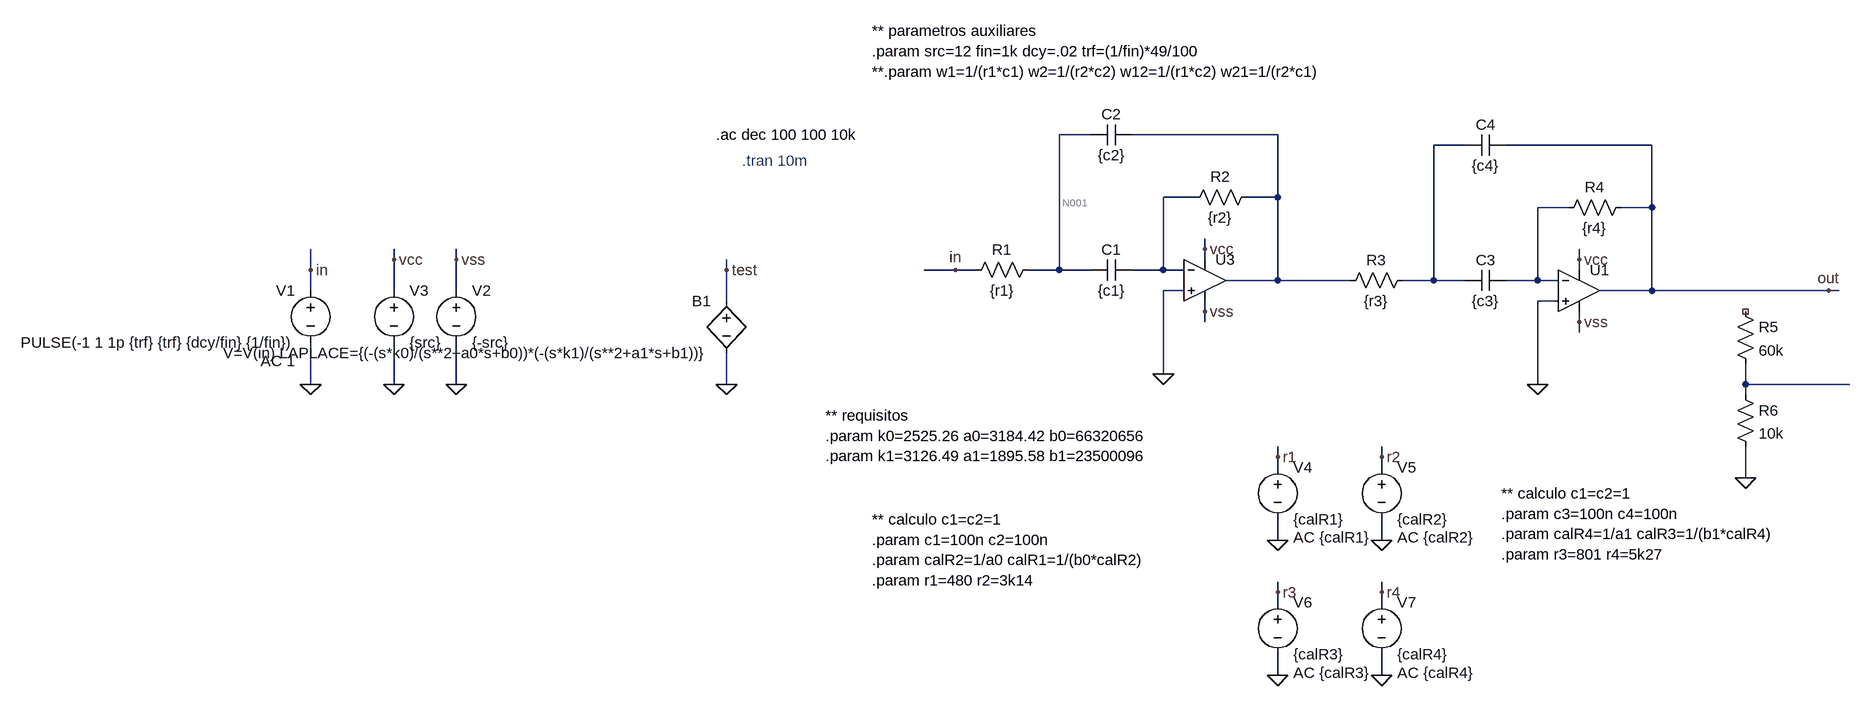
[diagram p0: schematic negFeddbackBP.asc]
negFeddbackBP.asc, the LTspice schematic file:
Version 4
SHEET 1 1924 680
WIRE 752 -304 704 -304
WIRE 1040 -304 816 -304
WIRE 1328 -288 1280 -288
WIRE 1616 -288 1392 -288
WIRE 912 -208 864 -208
WIRE 1040 -208 1040 -304
WIRE 1040 -208 992 -208
WIRE 1488 -192 1440 -192
WIRE 1616 -192 1616 -288
WIRE 1616 -192 1568 -192
WIRE 928 -128 928 -144
WIRE -320 -112 -320 -128
WIRE -224 -112 -224 -128
WIRE 928 -112 928 -128
WIRE 1504 -112 1504 -128
WIRE -448 -96 -448 -128
WIRE 192 -96 192 -112
WIRE 544 -96 496 -96
WIRE 576 -96 544 -96
WIRE 704 -96 704 -304
WIRE 704 -96 656 -96
WIRE 752 -96 704 -96
WIRE 864 -96 864 -208
WIRE 864 -96 816 -96
WIRE 896 -96 864 -96
WIRE 1504 -96 1504 -112
WIRE 1040 -80 1040 -208
WIRE 1040 -80 960 -80
WIRE 1152 -80 1040 -80
WIRE 1280 -80 1280 -288
WIRE 1280 -80 1232 -80
WIRE 1328 -80 1280 -80
WIRE 1440 -80 1440 -192
WIRE 1440 -80 1392 -80
WIRE 1472 -80 1440 -80
WIRE -448 -64 -448 -96
WIRE -320 -64 -320 -112
WIRE -224 -64 -224 -112
WIRE 896 -64 864 -64
WIRE 1616 -64 1616 -192
WIRE 1616 -64 1536 -64
WIRE 1888 -64 1616 -64
WIRE 1904 -64 1888 -64
WIRE 192 -48 192 -96
WIRE 1472 -48 1440 -48
WIRE 928 -32 928 -48
WIRE 928 -16 928 -32
WIRE 1504 -16 1504 -32
WIRE 1504 0 1504 -16
WIRE 864 64 864 -64
WIRE -448 80 -448 16
WIRE -320 80 -320 16
WIRE -224 80 -224 16
WIRE 192 80 192 32
WIRE 1440 80 1440 -48
WIRE 1760 80 1760 48
WIRE 1920 80 1760 80
WIRE 1760 96 1760 80
WIRE 1040 192 1040 176
WIRE 1200 192 1200 176
WIRE 1040 208 1040 192
WIRE 1200 208 1200 192
WIRE 1760 224 1760 176
WIRE 1040 320 1040 288
WIRE 1200 320 1200 288
WIRE 1040 400 1040 384
WIRE 1200 400 1200 384
WIRE 1040 416 1040 400
WIRE 1200 416 1200 400
WIRE 1040 528 1040 496
WIRE 1200 528 1200 496
FLAG -448 80 0
FLAG -224 80 0
FLAG -320 80 0
FLAG -320 -112 vcc
FLAG -224 -112 vss
FLAG -448 -96 in
FLAG 192 80 0
FLAG 928 -128 vcc
FLAG 928 -32 vss
FLAG 864 64 0
FLAG 192 -96 test
FLAG 1040 320 0
FLAG 1040 192 r1
FLAG 1200 320 0
FLAG 1200 192 r2
FLAG 1504 -112 vcc
FLAG 1504 -16 vss
FLAG 1440 80 0
FLAG 1888 -64 out
FLAG 1040 528 0
FLAG 1040 400 r3
FLAG 1200 528 0
FLAG 1200 400 r4
FLAG 544 -96 in
FLAG 1760 224 0
SYMBOL voltage -448 -80 M0
WINDOW 123 24 124 Left 2
WINDOW 39 0 0 Left 0
SYMATTR Value2 AC 1
SYMATTR InstName V1
SYMATTR Value PULSE(-1 1 1p {trf} {trf} {dcy/fin} {1/fin})
SYMBOL voltage -224 -80 R0
WINDOW 123 0 0 Left 0
WINDOW 39 0 0 Left 0
SYMATTR InstName V2
SYMATTR Value {-src}
SYMBOL voltage -320 -80 R0
WINDOW 123 0 0 Left 0
WINDOW 39 0 0 Left 0
SYMATTR InstName V3
SYMATTR Value {src}
SYMBOL bv 192 -64 M0
SYMATTR InstName B1
SYMATTR Value V=V(in) LAPLACE={(-(s*k0)/(s**2+a0*s+b0))*(-(s*k1)/(s**2+a1*s+b1))}
SYMBOL OpAmps\\UniversalOpamp 928 -80 R0
SYMATTR InstName U3
SYMBOL res 672 -112 R90
WINDOW 0 0 56 VBottom 2
WINDOW 3 32 56 VTop 2
SYMATTR InstName R1
SYMATTR Value {r1}
SYMBOL res 1008 -224 R90
WINDOW 0 0 56 VBottom 2
WINDOW 3 32 56 VTop 2
SYMATTR InstName R2
SYMATTR Value {r2}
SYMBOL cap 816 -112 R90
WINDOW 0 0 32 VBottom 2
WINDOW 3 32 32 VTop 2
SYMATTR InstName C1
SYMATTR Value {c1}
SYMBOL cap 816 -320 R90
WINDOW 0 0 32 VBottom 2
WINDOW 3 32 32 VTop 2
SYMATTR InstName C2
SYMATTR Value {c2}
SYMBOL voltage 1040 192 R0
WINDOW 123 24 124 Left 2
WINDOW 39 0 0 Left 0
SYMATTR InstName V4
SYMATTR Value {calR1}
SYMATTR Value2 AC {calR1}
SYMBOL voltage 1200 192 R0
WINDOW 123 24 124 Left 2
WINDOW 39 0 0 Left 0
SYMATTR InstName V5
SYMATTR Value {calR2}
SYMATTR Value2 AC {calR2}
SYMBOL OpAmps\\UniversalOpamp 1504 -64 R0
SYMATTR InstName U1
SYMBOL res 1248 -96 R90
WINDOW 0 0 56 VBottom 2
WINDOW 3 32 56 VTop 2
SYMATTR InstName R3
SYMATTR Value {r3}
SYMBOL res 1584 -208 R90
WINDOW 0 0 56 VBottom 2
WINDOW 3 32 56 VTop 2
SYMATTR InstName R4
SYMATTR Value {r4}
SYMBOL cap 1392 -96 R90
WINDOW 0 0 32 VBottom 2
WINDOW 3 32 32 VTop 2
SYMATTR InstName C3
SYMATTR Value {c3}
SYMBOL cap 1392 -304 R90
WINDOW 0 0 32 VBottom 2
WINDOW 3 32 32 VTop 2
SYMATTR InstName C4
SYMATTR Value {c4}
SYMBOL voltage 1040 400 R0
WINDOW 123 24 124 Left 2
WINDOW 39 0 0 Left 0
SYMATTR InstName V6
SYMATTR Value {calR3}
SYMATTR Value2 AC {calR3}
SYMBOL voltage 1200 400 R0
WINDOW 123 24 124 Left 2
WINDOW 39 0 0 Left 0
SYMATTR InstName V7
SYMATTR Value {calR4}
SYMATTR Value2 AC {calR4}
SYMBOL res 1744 -48 R0
SYMATTR InstName R5
SYMATTR Value 60k
SYMBOL res 1744 80 R0
SYMATTR InstName R6
SYMATTR Value 10k
TEXT 176 -304 Left 2 !.ac dec 100 100 10k
TEXT 216 -264 Left 2 ;.tran 10m
TEXT 416 -464 Left 2 !** parametros auxiliares\n.param src=12 fin=1k dcy=.02 trf=(1/fin)*49/100\n**.param w1=1/(r1*c1) w2=1/(r2*c2) w12=1/(r1*c2) w21=1/(r2*c1)
TEXT 344 128 Left 2 !** requisitos\n.param k0=2525.26 a0=3184.42 b0=66320656\n.param k1=3126.49 a1=1895.58 b1=23500096
TEXT 416 288 Left 2 !** calculo c1=c2=1\n.param c1=100n c2=100n\n.param calR2=1/a0 calR1=1/(b0*calR2)\n.param r1=480 r2=3k14
TEXT 1384 248 Left 2 !** calculo c1=c2=1\n.param c3=100n c4=100n\n.param calR4=1/a1 calR3=1/(b1*calR4)\n.param r3=801 r4=5k27

The netlist it stands for:
* negFeddbackBP.asc
V1 in 0 PULSE(-1 1 1p {trf} {trf} {dcy/fin} {1/fin}) AC 1
V2 vss 0 {-src}
V3 vcc 0 {src}
B1 test 0 V=V(in) LAPLACE={(-(s*k0)/(s**2+a0*s+b0))*(-(s*k1)/(s**2+a1*s+b1))}
XU3 0 N004 vcc vss N002 level1 Avol=1Meg GBW=10Meg Vos=0 En=0 Enk=0 In=0 Ink=0 Rin=500Meg  ; pins In+ In- V+ V- OUT
R1 N001 in {r1}
R2 N002 N004 {r2}
C1 N004 N001 {c1}
C2 N002 N001 {c2}
V4 r1 0 {calR1} AC {calR1}
V5 r2 0 {calR2} AC {calR2}
XU1 0 N005 vcc vss out level1 Avol=1Meg GBW=10Meg Vos=0 En=0 Enk=0 In=0 Ink=0 Rin=500Meg  ; pins In+ In- V+ V- OUT
R3 N003 N002 {r3}
R4 out N005 {r4}
C3 N005 N003 {c3}
C4 out N003 {c4}
V6 r3 0 {calR3} AC {calR3}
V7 r4 0 {calR4} AC {calR4}
R5 NC_01 N006 60k
R6 N006 0 10k
.ac dec 100 100 10k
* .tran 10m
** parametros auxiliares
.param src=12 fin=1k dcy=.02 trf=(1/fin)*49/100
**.param w1=1/(r1*c1) w2=1/(r2*c2) w12=1/(r1*c2) w21=1/(r2*c1)
** requisitos
.param k0=2525.26 a0=3184.42 b0=66320656
.param k1=3126.49 a1=1895.58 b1=23500096
** calculo c1=c2=1
.param c1=100n c2=100n
.param calR2=1/a0 calR1=1/(b0*calR2)
.param r1=480 r2=3k14
** calculo c1=c2=1
.param c3=100n c4=100n
.param calR4=1/a1 calR3=1/(b1*calR4)
.param r3=801 r4=5k27
.lib UniversalOpAmp1.lib
.backanno
.end

* Results of the author's LTspice run, read from the files saved beside the schematic
* Operating Point, zero values left out:
*   V(in) = -1 V
*   V(vss) = -12 V
*   V(vcc) = 12 V
*   V(test) = -1 V
*   V(n001) = -1 V
*   V(r1) = 48.02 µV
*   V(r2) = 314 µV
*   V(r3) = 80.66 µV
*   V(r4) = 527.5 µV
*   I(V3) = -48 nA
*   I(V2) = 48 nA
*   Ix(u3:3) = 24 nA
*   Ix(u3:4) = -24 nA
*   Ix(u1:3) = 24 nA
*   Ix(u1:4) = -24 nA
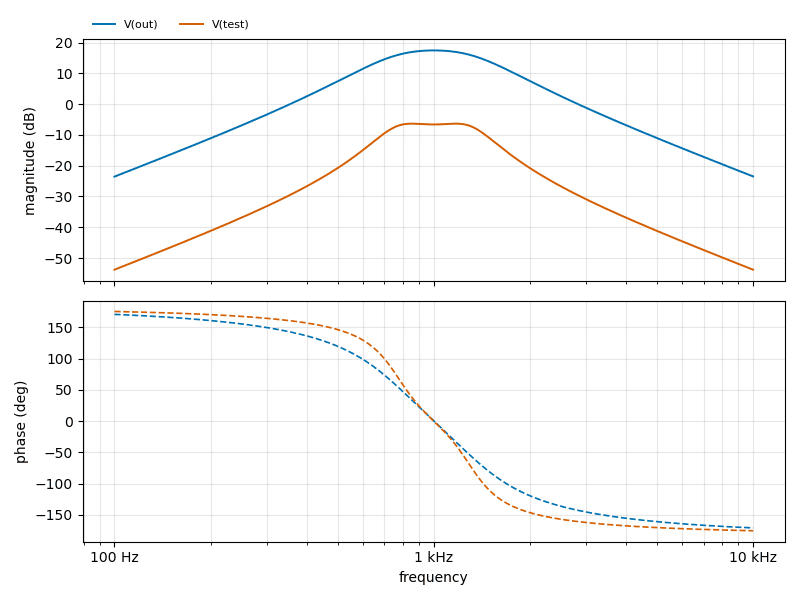
[diagram p1: AC Analysis of negFeddbackBP.asc, plotted from the saved traces]
* AC Analysis, 1 run:
*   V(out): -23.56 dB at 100 Hz, -23.49 dB at 10 kHz, peak 17.44 dB at 1 kHz, 3 dB below the peak at 695.8 Hz and 1.442 kHz
*   V(test): -53.80 dB at 100 Hz, -53.80 dB at 10 kHz, peak -6.36 dB at 1.175 kHz, 3 dB below the peak at 703.2 Hz and 1.422 kHz